# EAGLE design ArduOSD_Simple2222 (EAGLE 6.2)
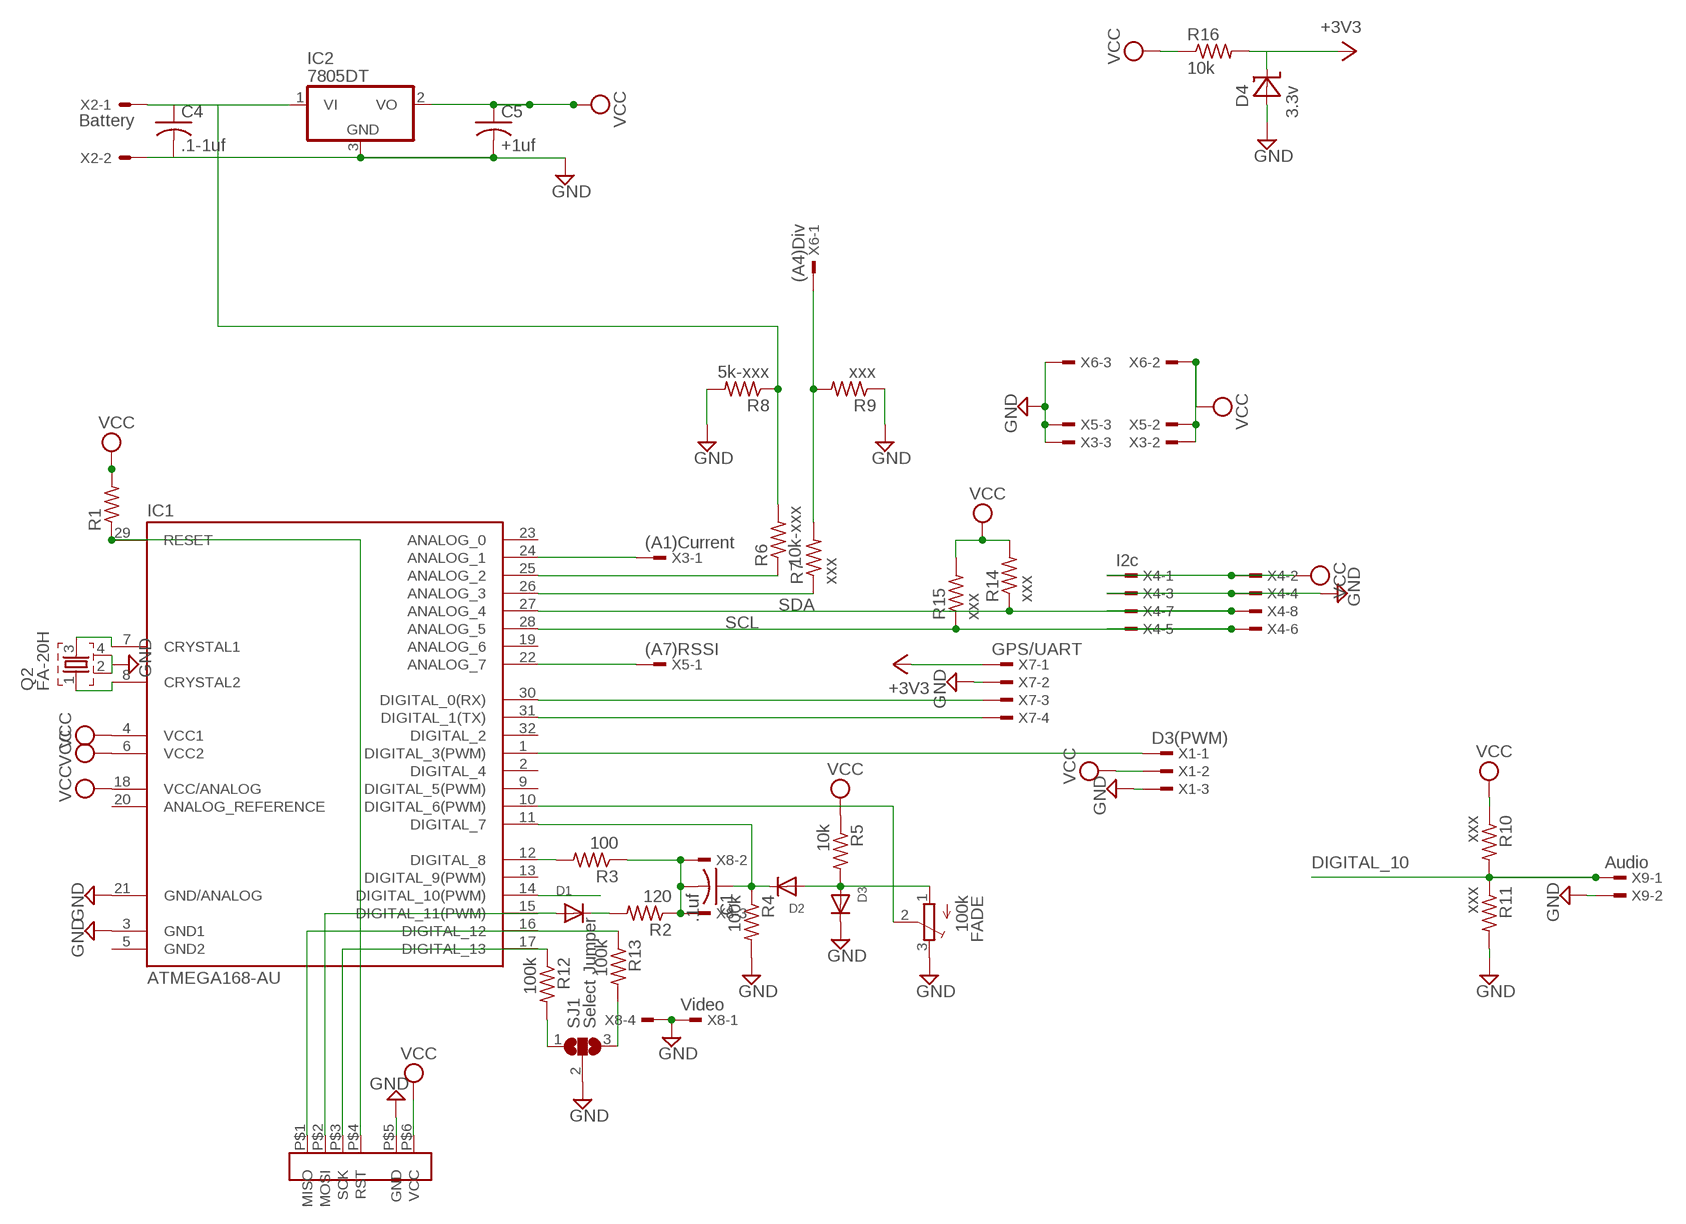
[diagram p0: schematic, sheet 1]

## Parts
C1  .1uf  C-USC0805K  [C0805K]
C4  .1-1uf  C-USC0805K  [C0805K]
C5  +1uf  C-USC0805K  [C0805K]
D1  DIODESOT23_WAVE  [SOT23-W]
D2  DIODESOT23_WAVE  [SOT23-W]
D3  DIODESOT23_WAVE  [SOT23-W]
D4  3.3v  ZENER_SOD123  [SOD-123]
FADE  100k  TRIMPOTTC33X  [TC33X]
IC1  ATMEGA168-AU  [TQFP32-08]
IC2  7805DT  [TO252]
Q2  FA-20H  [FA-20H]
R1  R-US_R0805  [R0805]
R2  120  R-US_R0805  [R0805]
R3  100  R-US_R0805  [R0805]
R4  100k  R-US_R0805  [R0805]
R5  10k  R-US_R0805  [R0805]
R6  10k-xxx  R-US_R0805  [R0805]
R7  xxx  R-US_R0805  [R0805]
R8  5k-xxx  R-US_R0805  [R0805]
R9  xxx  R-US_R0805  [R0805]
R10  xxx  R-US_R0805  [R0805]
R11  xxx  R-US_R0805  [R0805]
R12  100k  R-US_R0805  [R0805]
R13  100k  R-US_R0805  [R0805]
R14  xxx  R-US_R0805  [R0805]
R15  xxx  R-US_R0805  [R0805]
R16  10k  R-US_R0805  [R0805]
SJ1  Select Jumper  SJ2W  [SJ_2]
U$1  LIN_ISP  [LINEAR_ISP]
X1  D3(PWM)  TSW-103-02-S-S  [TSW-103-02-S-S]
X2  Battery  22-23-2021  [22-23-2021]
X3  (A1)Current  TSW-103-02-S-S  [TSW-103-02-S-S]
X4  I2c  TSW-104-02-S-D-RA  [TSW-104-02-S-D-RA]
X5  (A7)RSSI  TSW-103-02-S-S  [TSW-103-02-S-S]
X6  (A4)Div  TSW-103-02-S-S  [TSW-103-02-S-S]
X7  GPS/UART  TSW-104-02-S-S-RA  [TSW-104-02-S-S-RA]
X8  Video  TSW-104-02-S-S-RA  [TSW-104-02-S-S-RA]
X9  Audio  TSW-102-02-S-S-RA  [TSW-102-02-S-S-RA]

## Nets
+3V3: D4.1(C) R16.2 X7.1
BATT_FPV: C4.1 IC2.1(VI) R6.2 R8.1 X2.1
DIGITAL_10: IC1.14(DIGITAL_10(PWM)) R10.2 R11.1 X9.1
GND: C4.2 C5.2 D3.3(C) D4.2(A) FADE.3(E) IC1.3(GND1) IC1.21(GND/ANALOG) IC2.3(GND) Q2.2 Q2.4 R4.2 R8.2 R9.1 R11.2 SJ1.2 U$1.P$5(GND) X1.3 X2.2 X3.3 X4.3 X4.4 X5.3 X6.3 X7.2 X8.1 X8.4 X9.2
N$1: IC1.29(RESET) R1.1 U$1.P$4(RST)
N$2: D1.1(A) IC1.15(DIGITAL_11(PWM)) U$1.P$2(MOSI)
N$3: D1.3(C) R2.2
N$4: IC1.12(DIGITAL_8) R3.2
N$5: C1.2 R2.1 R3.1 X8.2 X8.3
N$6: C1.1 D2.3(C) IC1.11(DIGITAL_7) R4.1
N$7: D2.1(A) D3.1(A) FADE.1(A) R5.2
N$8: FADE.2(S) IC1.10(DIGITAL_6(PWM))
N$10: IC1.26(ANALOG_3) R7.1
N$11: IC1.7(CRYSTAL1) Q2.3
N$13: IC1.25(ANALOG_2) R6.1
N$14: IC1.22(ANALOG_7) X5.1
N$15: IC1.16(DIGITAL_12) R13.1 U$1.P$1(MISO)
N$16: IC1.17(DIGITAL_13) R12.1 U$1.P$3(SCK)
N$17: IC1.24(ANALOG_1) X3.1
N$18: IC1.1(DIGITAL_3(PWM)) X1.1
N$19: R7.2 R9.2 X6.1
N$20: R12.2 SJ1.1
N$21: R13.2 SJ1.3
N$24: IC1.8(CRYSTAL2) Q2.1
RX: IC1.30(DIGITAL_0(RX)) X7.3
SCL: IC1.28(ANALOG_5) R15.1 X4.5 X4.6
SDA: IC1.27(ANALOG_4) R14.1 X4.7 X4.8
TX: IC1.31(DIGITAL_1(TX)) X7.4
VCC: C5.1 IC1.4(VCC1) IC1.6(VCC2) IC1.18(VCC/ANALOG) IC2.2(VO) R1.2 R5.1 R10.1 R14.2 R15.2 R16.1 U$1.P$6(VCC) X1.2 X3.2 X4.1 X4.2 X5.2 X6.2
Unconnected: IC1.2(DIGITAL_4) IC1.9(DIGITAL_5(PWM)) IC1.13(DIGITAL_9(PWM)) IC1.19(ANALOG_6) IC1.20(ANALOG_REFERENCE) IC1.23(ANALOG_0) IC1.32(DIGITAL_2)

## Power pins joined to a net without a drawn wire
GND2: IC1.5(GND2)

## Library data of the parts
C1 C4 C5 = adafruit:C-US: CAPACITOR, American symbol
D1-D3 = adafruit:DIODE: Diode SMADIODE - SMA Surface Mount Package 20V 1A Schottky Diode Digikey: 641-1014-6-ND DO-1N4148 - Through Hole Small Current Diode SOD-123 20V 1 A (.5mV Vf) Schottky Diode - Digikey: MBRX120TPMSCT-ND SOD-323 10V 570mA (.38mV Vf, 3ns) Schottky Diode - Digikey: ZLLS410CT-ND SOD-523 30V 30mA Schottky Diode (RB751S-40TE61) - Digikey: RB751S-40TE61CT-ND SOT23-R/W - SOT23 Package (R = Solder Paste/Reflow Ovens, W = Hand-Soldering) BAT54Film 40V 300mA - Digikey: 497-7162-1-ND
D4 = wheat:ZENER_SOD123: ZENER DIODE, SOD123
FADE = adafruit:TRIMPOT: SMT trimmer potentiometer part number TC33X http://www.ladyada.net/library/eagle
IC1 = Arduino-AVR:ATMEGA168
IC2 = adafruit:78*: Positive VOLTAGE REGULATOR Added bigger pads to the TO-92 package
Q2 = crystal:FA-: MHz RANGE CRYSTAL UNIT Source: Epson Toyocom
R1-R16 = adafruit:R-US_: RESISTOR, American symbol
SJ1 = jumper:SJ2W: SMD solder JUMPER
U$1 = Legot:LIN_ISP: ISP or ICSP for AVR chips. 6 pin 1: Mosi 2: Miso 3: SCK 4: RST 5: GND 6: VCC
X1 X3 X5 X6 = con-samtec:TSW-103-02-S-S: THROUGH-HOLE .025" SQ POST HEADER Source: Samtec TSW.pdf; OC_FARNELL: unknown; OC_NEWARK: unknown
X2 = con-molex:22-23-2021: .100" (2.54mm) Center Header - 2 Pin; MF: MOLEX; MPN: 22-23-2021; OC_FARNELL: 1462926; OC_NEWARK: 25C3832
X4 = con-samtec:TSW-104-02-S-D: THROUGH-HOLE .025" SQ POST HEADER Source: Samtec TSW.pdf; OC_FARNELL: unknown; OC_NEWARK: unknown
X7 X8 = con-samtec:TSW-104-02-S-S: THROUGH-HOLE .025" SQ POST HEADER Source: Samtec TSW.pdf; OC_FARNELL: unknown; OC_NEWARK: unknown
X9 = con-samtec:TSW-102-02-S-S: THROUGH-HOLE .025" SQ POST HEADER Source: Samtec TSW.pdf; OC_FARNELL: unknown; OC_NEWARK: unknown

## Board
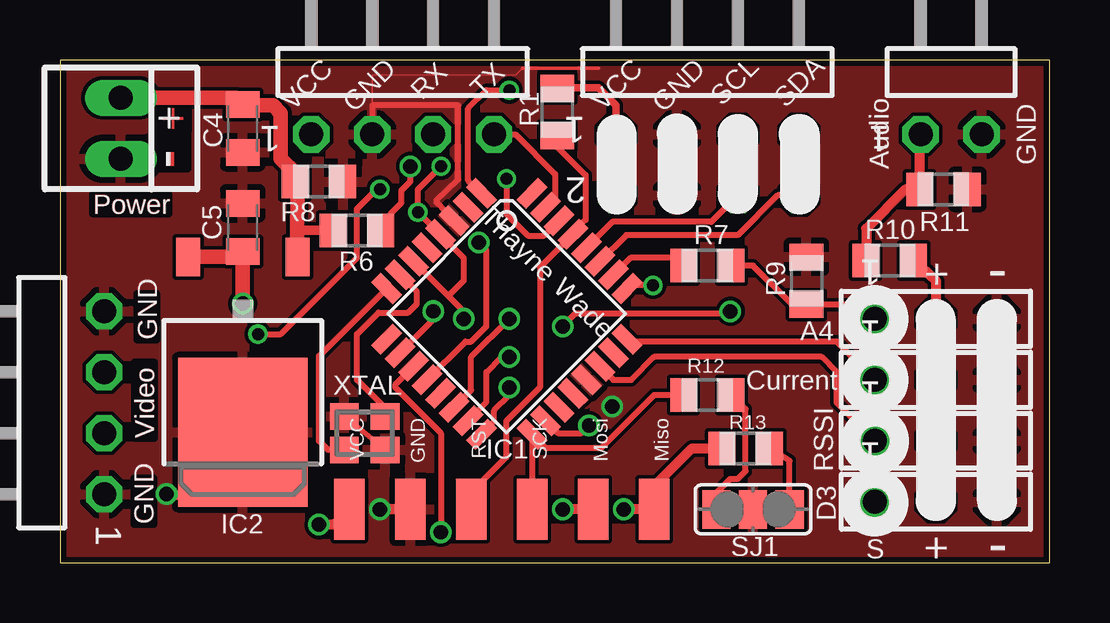
[diagram p1: board, top side]
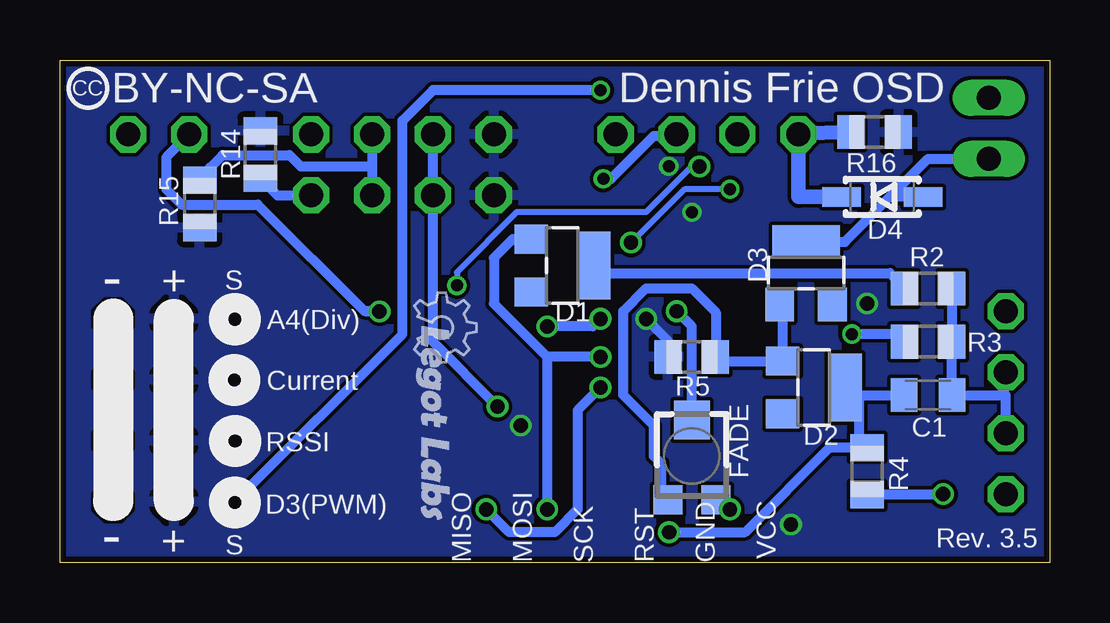
[diagram p2: board, bottom side, seen from below]

Size 41.26 x 20.95 mm. Coordinates in mm from the lower left corner, seen from the top.
Outline: 0,0 41.26,0 41.26,20.95 0,20.95 0,0
Copper layers (1*16): Top 0.035mm / dielectric 1.5mm / Bottom 0.035mm
Design rules: minimum track width 6mil, minimum drill 12mil, track to track 6mil, track to pad 6mil, pad to pad 6mil, via to via 6mil, smd to smd 0mil, copper to edge 10mil, drill to drill 10mil, minimum pad ring 10mil, minimum via ring 6mil, stop-mask expansion 2mil, vias tented up to drill 100mil, thermal gap 10mil

### Footprints (pad centres in the part's own frame; a part is rotated, then mirrored left to right if it is on the bottom)
C0805K = smd 1.1 x 1.4: 1 -1,0; 2 1,0
SOT23-W = smd 1.2 x 1.4: 1 -1.1,-1.3; 2 1.1,-1.3 | smd 2.8 x 1.4: 3 0,1.3
SOD-123 = smd 1.6 x 0.8: 1 -1.7,0; 2 1.7,0
TC33X = smd 1.2 x 1.2: 1 -1,-1.825; 3 1,-1.825 | smd 1.5 x 1.6: 2 0,1.5
TQFP32-08 = smd 1.27 x 0.559: 1 -4.293,2.8; 2 -4.293,2; 3 -4.293,1.2; 4 -4.293,0.4; 5 -4.293,-0.4; 6 -4.293,-1.2; 7 -4.293,-2; 8 -4.293,-2.8; 17 4.293,-2.8; 18 4.293,-2; 19 4.293,-1.2; 20 4.293,-0.4; 21 4.293,0.4; 22 4.293,1.2; 23 4.293,2; 24 4.293,2.8 | smd 0.559 x 1.27: 9 -2.8,-4.293; 10 -2,-4.293; 11 -1.2,-4.293; 12 -0.4,-4.293; 13 0.4,-4.293; 14 1.2,-4.293; 15 2,-4.293; 16 2.8,-4.293; 25 2.8,4.293; 26 2,4.293; 27 1.2,4.293; 28 0.4,4.293; 29 -0.4,4.293; 30 -1.2,4.293; 31 -2,4.293; 32 -2.8,4.293
TO252 = smd 1 x 1.6: 1 -2.28,-4.8; 2 2.28,-4.8 | smd 5.4 x 6.2: 3 0,2.5
FA-20H = smd 1.2 x 1.1: 1 -0.85,-0.7; 2 0.85,-0.7; 3 0.85,0.7; 4 -0.85,0.7
R0805 = smd 1.1 x 1.4: 1 -1,0; 2 1,0
SJ_2 = smd 1.168 x 1.6: 1 -1.524,0; 2 0,0; 3 1.524,0
LINEAR_ISP = smd 1.27 x 2.54: P$1 -6.35,0; P$2 -3.81,0; P$3 -1.27,0; P$4 1.27,0; P$5 3.81,0; P$6 6.35,0
TSW-103-02-S-S = drill 1 pad 1.5 octagon: 1 2.54,0; 2 0,0; 3 -2.54,0
22-23-2021 = drill 1 long: 1 -1.27,0; 2 1.27,0
TSW-104-02-S-D-RA = drill 1 pad 1.5 octagon: 1 3.81,1.524; 2 3.81,4.064; 3 1.27,1.524; 4 1.27,4.064; 5 -1.27,1.524; 6 -1.27,4.064; 7 -3.81,1.524; 8 -3.81,4.064
TSW-104-02-S-S-RA = drill 1 pad 1.5 octagon: 1 3.81,1.524; 2 1.27,1.524; 3 -1.27,1.524; 4 -3.81,1.524
TSW-102-02-S-S-RA = drill 1 pad 1.5 octagon: 1 1.27,1.524; 2 -1.27,1.524

### Placement (x,y rotation side)
C1  5.08,6.99 0 bottom
C4  7.62,18.1 270 top
C5  7.62,13.97 90 top
D1  20.32,12.38 270 bottom
D2  9.84,7.3 270 bottom
D3  10.16,12.06 0 bottom
D4  6.99,15.24 0 bottom
FADE  14.92,4.45 0 bottom
IC1  18.62,10.37 315 top
IC2  7.62,7.94 180 top
Q2  12.7,5.4 0 top
R1  20.73,18.78 90 top
R2  5.08,11.43 180 bottom
R3  5.08,9.21 180 bottom
R4  7.62,3.81 270 bottom
R5  14.92,8.57 0 bottom
R6  12.38,13.84 180 top
R7  26.99,12.38 0 top
R8  10.79,15.88 0 top
R9  31.11,11.75 270 top
R10  34.59,12.59 180 top
R11  36.83,15.56 0 top
R12  26.99,6.99 0 top
R13  28.57,4.76 0 top
R14  32.91,17 90 bottom
R15  35.44,14.95 270 bottom
R16  7.3,17.94 180 bottom
SJ1  28.89,2.22 0 top
U$1  18.41,2.22 180 top
X1  36.51,2.54 180 top
X2  2.54,18.1 270 top
X3  36.51,7.62 180 top
X4  26.99,19.37 180 top
X5  36.51,5.08 180 top
X6  36.51,10.16 180 top
X7  14.29,19.37 180 top
X8  0.32,6.67 270 top
X9  37.15,19.37 180 top

### Tracks (layer width: path | path; a pad name or v marks a point on that pad's centre or on a via)
+3V3
  Bottom 0.61: D4.1 10.48,15.24 X7.1 10.48,17.89 R16.2
BATT_FPV
  Top 0.406: R6.2 9.89,13.84
  Top 0.61: IC2.1 9.89,13.84 9.9,15.13 R8.1 9.79,16.24 9.21,16.83 9.21,18.73 8.89,19.05 7.67,19.05 C4.1 7.35,19.37 X2.1
DIGITAL_10  (via drill 0.6)
  Top 0.254: v20.95,9.84 21.5,10.38 27.94,10.39 v27.94,10.47 | IC1.14 17.14,7.19 17.14,8.57 v18.73,10.16
  Top 0.406: X9.1 35.83,17.8 R11.1 35.24,15.56 33.61,13.92 R10.2
  Bottom 0.406: v18.73,10.16 19.05,9.84 v20.95,9.84 | 28.51,10.48 v27.94,10.47 28.57,10.48 33.02,14.92 36.2,14.92 36.83,15.56 36.83,16.89 X9.1
GND  (via drill 0.6)
  Top 0: 19.27,20.61 18.98,20.32 13.02,20.32 X7.2
  Top 0.152: 19.27,20.61 22.45,20.61
  Top 0.203: Q2.2 Q2.4
  Top 0.254: X7.2 13.02,19.05 16.6,19.05 16.6,15.96 15.71,15.1 15.72,15.1 15.72,14.99 IC1.3 | IC1.21 21.94,7.59
  Top 0.305: IC2.3 R4.2
  Top 0.406: U$1.P$5 v13.34,2.22 | R4.2 4.45,2.81 v4.45,2.86
  Bottom 0.406: FADE.3 13.73,2.62 v13.34,2.22 | R4.2 7.57,2.86 v4.45,2.86 | D3.3 8.54,13.37 6.43,15.48 | 6.43,15.48 5.08,16.83 X2.2 | v23.02,6.51 25.72,9.21 X4.3 | D4.2 6.59,15.24 6.43,15.48
  pour Top: 0.32,20.64 40.96,20.64 40.96,0.32 0.32,0.32
N$1
  Top 0.254: 17.14,2.94 18.59,4.39 18.59,5.89 20,7.3 20,12.31 IC1.29 21.38,13.76 21.91,14.29 21.91,16.14 20.64,17.41 R1.1
  Top 0.406: U$1.P$4 17.14,2.94
N$2  (via drill 0.6)
  Top 0.254: IC1.15 17.78,6.7 17.78,7.94 18.41,8.57 v18.73,8.57
  Top 0.406: U$1.P$2 v20.95,2.22
  Bottom 0.406: D1.1 22.39,13.48 23.18,12.7 23.18,10.79 20.95,8.57 | 20.95,8.57 v20.95,2.22 | v18.73,8.57 20.95,8.57
N$3
  Bottom 0.406: D1.3 18.7,12.06 6.67,12.06 6.08,11.48 R2.2
N$4  (via drill 0.5, 0.5 pad 0.25, 0.6)
  Top 0.254: IC1.12 16.9,9.21 17.14,9.21 17.78,9.84 17.78,13.02 v17.46,13.34 | v8.26,9.53 9.21,9.53 12.38,12.7 12.38,14.74 13.2,15.56 v13.34,15.56
  Bottom 0.254: R3.2 6.4,9.53 | v13.34,15.56 15.24,15.56 v17.46,13.34
  Bottom 0.406: 6.4,9.53 v8.26,9.53
N$5
  Bottom 0.406: R2.1 R3.1 C1.2 1.91,6.99 | 1.91,6.99 1.91,7.94 X8.3 | X8.2 1.84,6.99 1.91,6.99
N$6  (via drill 0.6)
  Top 0.254: IC1.11 13.97,7.41 13.97,7.3 15.88,5.4 v15.88,1.27
  Bottom 0.406: D2.3 8.22,6.99 7.94,6.99 | 7.94,6.99 C1.1 | 7.94,6.99 7.94,4.49 R4.1 9.16,4.81 12.7,1.27 v15.88,1.27
N$7
  Bottom 0.406: D3.1 11.14,10.65 D2.1 13.75,8.4 R5.2 13.92,10.43 14.92,11.43 16.83,11.43 17.78,10.48 17.78,6.99 16.51,5.71 16.51,4.45 16.19,4.13 16.19,2.86 15.96,2.62 FADE.1
N$8  (via drill 0.6)
  Top 0.254: v15.56,10.48 15.56,10.13 IC1.10
  Bottom 0.406: FADE.2 14.92,9.84 v15.56,10.48
N$9
  Bottom 0.406: 6.03,15.4 6.19,15.4
N$10
  Top 0.254: R7.1 25.99,12.43 25.72,12.7 23.78,12.7 IC1.26
N$11
  Top 0.254: Q2.3 13.55,6.45 12.38,7.62 12.38,9.53 13.27,10.42 14.52,10.42 14.88,10.78 14.88,11.29 IC1.7
N$13  (via drill 0.5, 0.6 pad 0.25)
  Top 0.254: v24.72,11.55 23.87,11.55 IC1.25 | v14.61,16.51 14.61,15.88 14.6,15.88 14.23,15.51 14.23,15 13.78,14.54 13.78,14.48 13.68,14.37 13.68,14.31 13.38,14.02 R6.1
  Bottom 0.254: v14.61,16.51 14.92,16.51 16.83,14.61 22.23,14.61 24.72,12.1 v24.72,11.55
N$14
  Top 0.254: X5.1 32.38,6.67 32.38,7.94 31.75,8.57 24.77,8.57 23.81,7.62 23.07,7.62 IC1.22
N$15  (via drill 0.6)
  Top 0.254: IC1.16 18.1,5.88 18.1,6.35 18.73,6.99 v18.73,7.3
  Top 0.406: v23.5,2.22 U$1.P$1 24.77,3.17 26.35,4.76 R13.1
  Bottom 0.406: v18.73,7.3 19.68,6.35 19.68,2.22 20.64,1.27 22.54,1.27 v23.5,2.22
N$16
  Top 0.254: U$1.P$3 IC1.17 20.27,4.76 22.54,4.76 24.77,6.99 R12.1
  Top 0.406: U$1.P$3
N$17
  Top 0.254: X3.1 32.38,9.21 23.81,9.21 23.6,9.31 IC1.24
N$18  (via drill 0.5)
  Top 0.254: IC1.1 17.02,15.92 17.02,18.92 17.78,19.68 v18.73,19.68
  Bottom 0.406: X1.1 26.99,9.53 26.99,18.41 25.72,19.68 v18.73,19.68
N$19
  Top 0.254: X6.1 33.38,10.75 R9.2 31.07,10.79 30.48,10.79 28.89,12.38 R7.2
N$20
  Top 0.254: SJ1.1 27.37,2.92 27.94,3.49 28.26,3.49 28.57,3.81 28.57,6.4 R12.2
N$21
  Top 0.254: SJ1.3 30.42,4.24 R13.2
N$24
  Top 0.254: Q2.1 11.18,4.7 10.79,5.08 10.79,8.61 IC1.8
RX  (via drill 0.5)
  Top 0.254: v18.61,16 v18.62,15.99 18.62,14.51 19.5,13.62 20.18,13.62 IC1.30
  Bottom 0.406: v18.61,16 18.29,16 16.51,17.78 15.62,17.78 X7.3
SCL
  Top 0.254: X4.6 27.16,14.2 23.02,14.2 IC1.28
  Bottom 0.406: X4.5 28.26,16.51 | 28.26,16.51 X4.6 | 28.26,16.51 31.23,16.51 31.71,16.99 31.71,16.98 34.48,16.98 35.44,16.03 R15.1
SDA
  Top 0.254: IC1.27 23.61,13.65 28.26,13.65 29.91,15.3 X4.8
  Top 0.406: X4.8 X4.7
  Bottom 0.406: R14.1 32.21,15.3 X4.8
TX
  Top 0.254: X7.4 18.99,17.84 20.64,16.19 20.64,15.21 IC1.31
VCC  (via drill 0.5, 0.5 pad 0.25, 0.6)
  Top 0.254: v16.83,10.16 16.83,10.47 IC1.6 16.18,11.11 16.19,11.11 16.83,11.75 16.83,12.7 15.87,13.66 | v14.92,14.61 15.84,13.69 IC1.4 15.87,13.66 | IC1.18 20.77,5.4 21.73,5.4 v22.05,5.71 | 15.87,13.66 v14.92,14.61 | v14.92,14.61 14.92,15.56 v15.89,16.52
  Top 0.305: R1.2 22.45,19.78 23.18,19.05 X4.1
  Top 0.406: 36.51,11.06 X6.2 36.51,11.75 R10.1 | U$1.P$6 11.43,1.59 v10.79,1.59
  Top 0.61: IC2.2 7.39,12.74 C5.1 v7.62,10.79
  Bottom 0.406: R5.1 15.92,9.26 v16.83,10.16
  pour Bottom: 0.32,20.64 40.96,20.64 40.96,0.32 0.32,0.32

### Text on the board
Top: + | - | Power | GND | Video | GND
tNames: VCC | GND | RX | TX | VCC | GND | SCL | SDA | + | GND | - | Audio | Power | Thayne | + | - | Wade | GND | A4 | XTAL | Current | Video | RSSI | GND | D3 | C:/Program Files (x86)/EAGLE_PCB/Legot Labs-Open Source BITMAP.bmp | S | + | -
bNames: Dennis Frie OSD | BY-NC-SA | CC | S | + | - | A4(Div) | Current | RSSI | D3(PWM) | Rev. 3.5 | VCC | GND | RST | SCK | MOSI | MISO | S | + | -